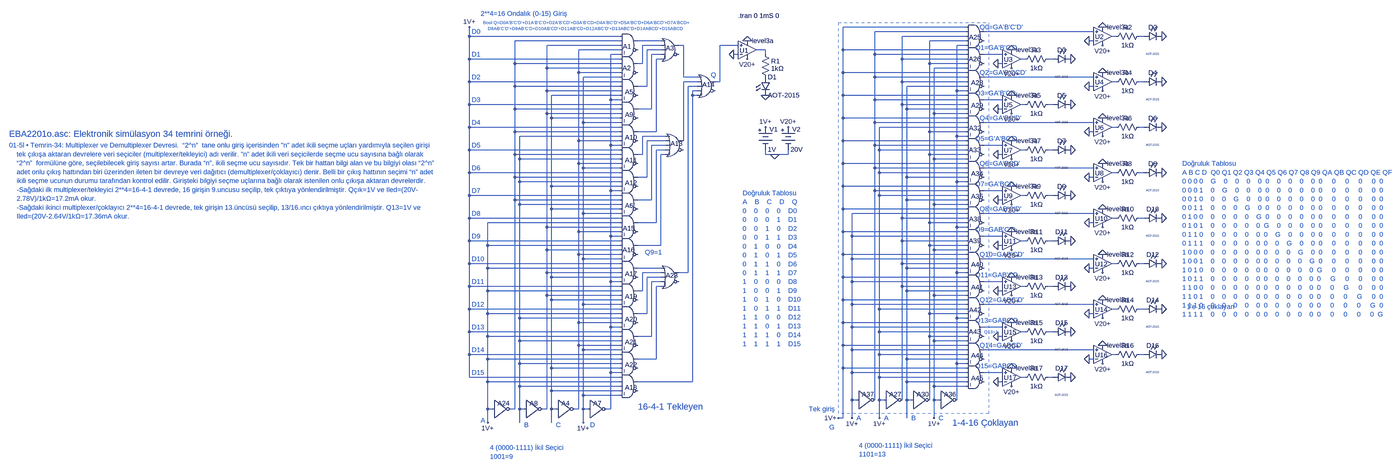
[diagram p0: schematic EBA2201o.asc, whole sheet]
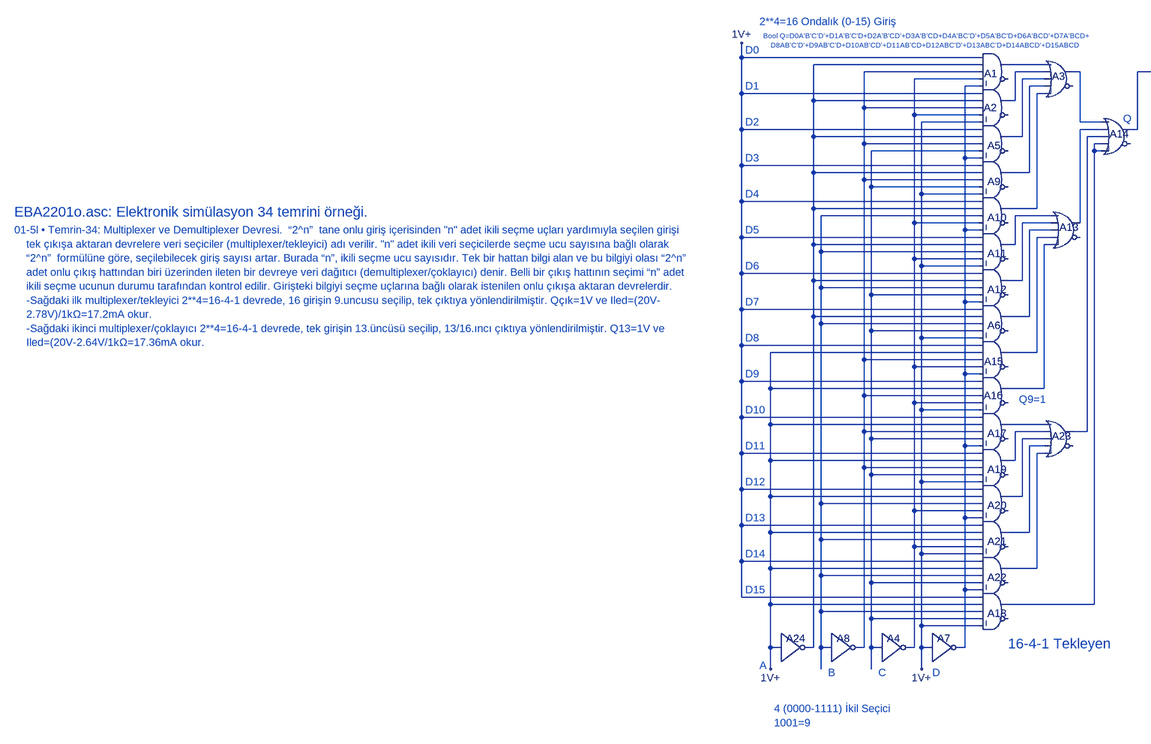
[diagram p1: schematic EBA2201o.asc, part, row 1 of 1, column 1 of 2]
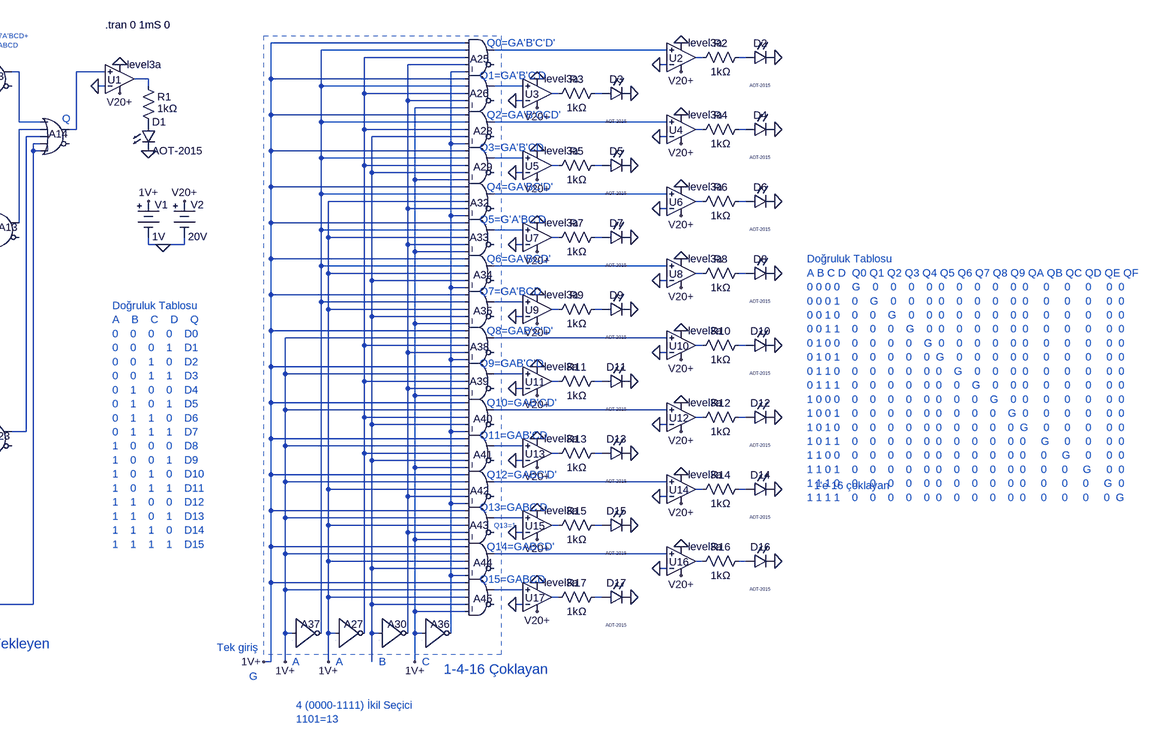
[diagram p2: schematic EBA2201o.asc, part, row 1 of 1, column 2 of 2]
EBA2201o.asc, the LTspice schematic file:
Version 4
SHEET 1 7064 4332
WIRE 4144 -320 3712 -320
WIRE 4144 -304 3824 -304
WIRE 4592 -304 4208 -304
WIRE 2400 -288 2400 -320
WIRE 2928 -288 2400 -288
WIRE 4144 -288 3920 -288
WIRE 4672 -288 4656 -288
WIRE 4768 -288 4752 -288
WIRE 2928 -272 2560 -272
WIRE 3072 -272 2992 -272
WIRE 4144 -272 4016 -272
WIRE 4592 -272 4576 -272
WIRE 2928 -256 2672 -256
WIRE 3072 -256 3008 -256
WIRE 3152 -256 3136 -256
WIRE 3344 -256 3280 -256
WIRE 4144 -256 4112 -256
WIRE 2928 -240 2784 -240
WIRE 3072 -240 3024 -240
WIRE 3440 -240 3408 -240
WIRE 3712 -240 3712 -320
WIRE 4144 -240 3712 -240
WIRE 2928 -224 2896 -224
WIRE 3072 -224 3040 -224
WIRE 3344 -224 3328 -224
WIRE 3440 -224 3440 -240
WIRE 3824 -224 3824 -304
WIRE 4144 -224 3824 -224
WIRE 4272 -224 4208 -224
WIRE 2400 -208 2400 -288
WIRE 2928 -208 2400 -208
WIRE 3072 -208 3056 -208
WIRE 3920 -208 3920 -288
WIRE 4144 -208 3920 -208
WIRE 4352 -208 4336 -208
WIRE 4448 -208 4432 -208
WIRE 2560 -192 2560 -272
WIRE 2928 -192 2560 -192
WIRE 3008 -192 3008 -256
WIRE 3008 -192 2992 -192
WIRE 4016 -192 4016 -272
WIRE 4144 -192 4016 -192
WIRE 4272 -192 4256 -192
WIRE 2672 -176 2672 -256
WIRE 2928 -176 2672 -176
WIRE 4144 -176 4032 -176
WIRE 2784 -160 2784 -240
WIRE 2928 -160 2784 -160
WIRE 3712 -160 3712 -240
WIRE 4144 -160 3712 -160
WIRE 2928 -144 2800 -144
WIRE 3152 -144 3152 -256
WIRE 3200 -144 3152 -144
WIRE 3824 -144 3824 -224
WIRE 4144 -144 3824 -144
WIRE 4592 -144 4208 -144
WIRE 2400 -128 2400 -208
WIRE 2928 -128 2400 -128
WIRE 3200 -128 3152 -128
WIRE 3280 -128 3280 -256
WIRE 3280 -128 3264 -128
WIRE 3920 -128 3920 -208
WIRE 4144 -128 3920 -128
WIRE 4672 -128 4656 -128
WIRE 4768 -128 4752 -128
WIRE 2560 -112 2560 -192
WIRE 2928 -112 2560 -112
WIRE 3024 -112 3024 -240
WIRE 3024 -112 2992 -112
WIRE 3200 -112 3168 -112
WIRE 4144 -112 3936 -112
WIRE 4592 -112 4576 -112
WIRE 2672 -96 2672 -176
WIRE 2928 -96 2672 -96
WIRE 3200 -96 3184 -96
WIRE 4112 -96 4112 -256
WIRE 4144 -96 4112 -96
WIRE 2928 -80 2688 -80
WIRE 3184 -80 3184 -96
WIRE 3200 -80 3184 -80
WIRE 3712 -80 3712 -160
WIRE 4144 -80 3712 -80
WIRE 2896 -64 2896 -224
WIRE 2928 -64 2896 -64
WIRE 3824 -64 3824 -144
WIRE 4144 -64 3824 -64
WIRE 4272 -64 4208 -64
WIRE 2400 -48 2400 -128
WIRE 2928 -48 2400 -48
WIRE 3920 -48 3920 -128
WIRE 4144 -48 3920 -48
WIRE 4352 -48 4336 -48
WIRE 4448 -48 4432 -48
WIRE 2560 -32 2560 -112
WIRE 2928 -32 2560 -32
WIRE 3040 -32 3040 -224
WIRE 3040 -32 2992 -32
WIRE 3936 -32 3936 -112
WIRE 4144 -32 3936 -32
WIRE 4272 -32 4256 -32
WIRE 2672 -16 2672 -96
WIRE 2928 -16 2672 -16
WIRE 4032 -16 4032 -176
WIRE 4144 -16 4032 -16
WIRE 2688 0 2688 -80
WIRE 2928 0 2688 0
WIRE 3712 0 3712 -80
WIRE 4144 0 3712 0
WIRE 2800 16 2800 -144
WIRE 2928 16 2800 16
WIRE 3824 16 3824 -64
WIRE 4144 16 3824 16
WIRE 4592 16 4208 16
WIRE 2400 32 2400 -48
WIRE 2928 32 2400 32
WIRE 4144 32 3840 32
WIRE 4672 32 4656 32
WIRE 4768 32 4752 32
WIRE 2560 48 2560 -32
WIRE 2928 48 2560 48
WIRE 3056 48 3056 -208
WIRE 3056 48 2992 48
WIRE 4016 48 4016 -192
WIRE 4144 48 4016 48
WIRE 4592 48 4576 48
WIRE 2928 64 2576 64
WIRE 3088 64 3008 64
WIRE 4112 64 4112 -96
WIRE 4144 64 4112 64
WIRE 2784 80 2784 -160
WIRE 2928 80 2784 80
WIRE 3088 80 3024 80
WIRE 3152 80 3152 -128
WIRE 3712 80 3712 0
WIRE 4144 80 3712 80
WIRE 2896 96 2896 -64
WIRE 2928 96 2896 96
WIRE 3088 96 3040 96
WIRE 3824 96 3824 16
WIRE 4144 96 3824 96
WIRE 4272 96 4208 96
WIRE 2400 112 2400 32
WIRE 2928 112 2400 112
WIRE 3088 112 3056 112
WIRE 3840 112 3840 32
WIRE 4144 112 3840 112
WIRE 4352 112 4336 112
WIRE 4448 112 4432 112
WIRE 2560 128 2560 48
WIRE 2928 128 2560 128
WIRE 3008 128 3008 64
WIRE 3008 128 2992 128
WIRE 3088 128 3072 128
WIRE 3440 128 3440 112
WIRE 3472 128 3440 128
WIRE 3520 128 3520 112
WIRE 3520 128 3472 128
WIRE 4016 128 4016 48
WIRE 4144 128 4016 128
WIRE 4272 128 4256 128
WIRE 2576 144 2576 64
WIRE 2928 144 2576 144
WIRE 4032 144 4032 -16
WIRE 4144 144 4032 144
WIRE 2784 160 2784 80
WIRE 2928 160 2784 160
WIRE 3712 160 3712 80
WIRE 4144 160 3712 160
WIRE 2800 176 2800 16
WIRE 2928 176 2800 176
WIRE 3824 176 3824 96
WIRE 4144 176 3824 176
WIRE 4592 176 4208 176
WIRE 2400 192 2400 112
WIRE 2928 192 2400 192
WIRE 3840 192 3840 112
WIRE 4144 192 3840 192
WIRE 4672 192 4656 192
WIRE 4768 192 4752 192
WIRE 2560 208 2560 128
WIRE 2928 208 2560 208
WIRE 3024 208 3024 80
WIRE 3024 208 2992 208
WIRE 3936 208 3936 -32
WIRE 4144 208 3936 208
WIRE 4592 208 4576 208
WIRE 2576 224 2576 144
WIRE 2928 224 2576 224
WIRE 4112 224 4112 64
WIRE 4144 224 4112 224
WIRE 2688 240 2688 0
WIRE 2928 240 2688 240
WIRE 3712 240 3712 160
WIRE 4144 240 3712 240
WIRE 2896 256 2896 96
WIRE 2928 256 2896 256
WIRE 3824 256 3824 176
WIRE 4144 256 3824 256
WIRE 4272 256 4208 256
WIRE 2400 272 2400 192
WIRE 2928 272 2400 272
WIRE 3840 272 3840 192
WIRE 4144 272 3840 272
WIRE 4352 272 4336 272
WIRE 4448 272 4432 272
WIRE 2560 288 2560 208
WIRE 2928 288 2560 288
WIRE 3040 288 3040 96
WIRE 3040 288 2992 288
WIRE 3936 288 3936 208
WIRE 4144 288 3936 288
WIRE 4272 288 4256 288
WIRE 2576 304 2576 224
WIRE 2928 304 2576 304
WIRE 4032 304 4032 144
WIRE 4144 304 4032 304
WIRE 2688 320 2688 240
WIRE 2928 320 2688 320
WIRE 3712 320 3712 240
WIRE 4144 320 3712 320
WIRE 2800 336 2800 176
WIRE 2928 336 2800 336
WIRE 4144 336 3744 336
WIRE 4592 336 4208 336
WIRE 2400 352 2400 272
WIRE 2928 352 2400 352
WIRE 3920 352 3920 -48
WIRE 4144 352 3920 352
WIRE 4672 352 4656 352
WIRE 4768 352 4752 352
WIRE 2928 368 2464 368
WIRE 3056 368 3056 112
WIRE 3056 368 2992 368
WIRE 4016 368 4016 128
WIRE 4144 368 4016 368
WIRE 4592 368 4576 368
WIRE 2672 384 2672 -16
WIRE 2928 384 2672 384
WIRE 4112 384 4112 224
WIRE 4144 384 4112 384
WIRE 2784 400 2784 160
WIRE 2928 400 2784 400
WIRE 3712 400 3712 320
WIRE 4144 400 3712 400
WIRE 2896 416 2896 256
WIRE 2928 416 2896 416
WIRE 3744 416 3744 336
WIRE 4144 416 3744 416
WIRE 4272 416 4208 416
WIRE 2400 432 2400 352
WIRE 2928 432 2400 432
WIRE 3920 432 3920 352
WIRE 4144 432 3920 432
WIRE 4352 432 4336 432
WIRE 4448 432 4432 432
WIRE 2464 448 2464 368
WIRE 2928 448 2464 448
WIRE 3072 448 3072 128
WIRE 3072 448 2992 448
WIRE 4016 448 4016 368
WIRE 4144 448 4016 448
WIRE 4272 448 4256 448
WIRE 2672 464 2672 384
WIRE 2928 464 2672 464
WIRE 4032 464 4032 304
WIRE 4144 464 4032 464
WIRE 2784 480 2784 400
WIRE 2928 480 2784 480
WIRE 3712 480 3712 400
WIRE 4144 480 3712 480
WIRE 2800 496 2800 336
WIRE 2928 496 2800 496
WIRE 3744 496 3744 416
WIRE 4144 496 3744 496
WIRE 4592 496 4208 496
WIRE 2400 512 2400 432
WIRE 2928 512 2400 512
WIRE 3920 512 3920 432
WIRE 4144 512 3920 512
WIRE 4672 512 4656 512
WIRE 4768 512 4752 512
WIRE 2464 528 2464 448
WIRE 2928 528 2464 528
WIRE 3072 528 2992 528
WIRE 3936 528 3936 288
WIRE 4144 528 3936 528
WIRE 4592 528 4576 528
WIRE 2672 544 2672 464
WIRE 2928 544 2672 544
WIRE 3072 544 3008 544
WIRE 3168 544 3168 -112
WIRE 3168 544 3136 544
WIRE 4112 544 4112 384
WIRE 4144 544 4112 544
WIRE 2688 560 2688 320
WIRE 2928 560 2688 560
WIRE 3072 560 3024 560
WIRE 3712 560 3712 480
WIRE 4144 560 3712 560
WIRE 2896 576 2896 416
WIRE 2928 576 2896 576
WIRE 3072 576 3040 576
WIRE 3744 576 3744 496
WIRE 4144 576 3744 576
WIRE 4272 576 4208 576
WIRE 2400 592 2400 512
WIRE 2928 592 2400 592
WIRE 3072 592 3056 592
WIRE 3920 592 3920 512
WIRE 4144 592 3920 592
WIRE 4352 592 4336 592
WIRE 4448 592 4432 592
WIRE 2464 608 2464 528
WIRE 2928 608 2464 608
WIRE 3008 608 3008 544
WIRE 3008 608 2992 608
WIRE 3936 608 3936 528
WIRE 4144 608 3936 608
WIRE 4272 608 4256 608
WIRE 2672 624 2672 544
WIRE 2928 624 2672 624
WIRE 4032 624 4032 464
WIRE 4144 624 4032 624
WIRE 2688 640 2688 560
WIRE 2928 640 2688 640
WIRE 3712 640 3712 560
WIRE 4144 640 3712 640
WIRE 2800 656 2800 496
WIRE 2928 656 2800 656
WIRE 3744 656 3744 576
WIRE 4144 656 3744 656
WIRE 4592 656 4208 656
WIRE 2400 672 2400 592
WIRE 2928 672 2400 672
WIRE 3840 672 3840 272
WIRE 4144 672 3840 672
WIRE 4672 672 4656 672
WIRE 4768 672 4752 672
WIRE 2464 688 2464 608
WIRE 2928 688 2464 688
WIRE 3024 688 3024 560
WIRE 3024 688 2992 688
WIRE 4016 688 4016 448
WIRE 4144 688 4016 688
WIRE 4592 688 4576 688
WIRE 2576 704 2576 304
WIRE 2928 704 2576 704
WIRE 4112 704 4112 544
WIRE 4144 704 4112 704
WIRE 2784 720 2784 480
WIRE 2928 720 2784 720
WIRE 3712 720 3712 640
WIRE 4144 720 3712 720
WIRE 2896 736 2896 576
WIRE 2928 736 2896 736
WIRE 3744 736 3744 656
WIRE 4144 736 3744 736
WIRE 4272 736 4208 736
WIRE 2400 752 2400 672
WIRE 2928 752 2400 752
WIRE 3840 752 3840 672
WIRE 4144 752 3840 752
WIRE 4352 752 4336 752
WIRE 4448 752 4432 752
WIRE 2464 768 2464 688
WIRE 2928 768 2464 768
WIRE 3040 768 3040 576
WIRE 3040 768 2992 768
WIRE 4016 768 4016 688
WIRE 4144 768 4016 768
WIRE 4272 768 4256 768
WIRE 2576 784 2576 704
WIRE 2928 784 2576 784
WIRE 4032 784 4032 624
WIRE 4144 784 4032 784
WIRE 2784 800 2784 720
WIRE 2928 800 2784 800
WIRE 3712 800 3712 720
WIRE 4144 800 3712 800
WIRE 2800 816 2800 656
WIRE 2928 816 2800 816
WIRE 3744 816 3744 736
WIRE 4144 816 3744 816
WIRE 4592 816 4208 816
WIRE 2400 832 2400 752
WIRE 2928 832 2400 832
WIRE 3840 832 3840 752
WIRE 4144 832 3840 832
WIRE 4672 832 4656 832
WIRE 4768 832 4752 832
WIRE 2464 848 2464 768
WIRE 2928 848 2464 848
WIRE 3056 848 3056 592
WIRE 3056 848 2992 848
WIRE 3936 848 3936 608
WIRE 4144 848 3936 848
WIRE 4592 848 4576 848
WIRE 2576 864 2576 784
WIRE 2928 864 2576 864
WIRE 4112 864 4112 704
WIRE 4144 864 4112 864
WIRE 2688 880 2688 640
WIRE 2928 880 2688 880
WIRE 3712 880 3712 800
WIRE 4144 880 3712 880
WIRE 2896 896 2896 736
WIRE 2928 896 2896 896
WIRE 3744 896 3744 816
WIRE 4144 896 3744 896
WIRE 4272 896 4208 896
WIRE 2400 912 2400 832
WIRE 2928 912 2400 912
WIRE 3840 912 3840 832
WIRE 4144 912 3840 912
WIRE 4352 912 4336 912
WIRE 4448 912 4432 912
WIRE 2464 928 2464 848
WIRE 2928 928 2464 928
WIRE 3184 928 3184 -80
WIRE 3184 928 2992 928
WIRE 3936 928 3936 848
WIRE 4144 928 3936 928
WIRE 4272 928 4256 928
WIRE 2576 944 2576 864
WIRE 2928 944 2576 944
WIRE 4032 944 4032 784
WIRE 4144 944 4032 944
WIRE 2688 960 2688 880
WIRE 2928 960 2688 960
WIRE 2800 976 2800 816
WIRE 2928 976 2800 976
WIRE 3744 992 3744 896
WIRE 3760 992 3744 992
WIRE 3824 992 3824 256
WIRE 3840 992 3840 912
WIRE 3856 992 3840 992
WIRE 3920 992 3920 592
WIRE 3936 992 3936 928
WIRE 3952 992 3936 992
WIRE 4016 992 4016 768
WIRE 4032 992 4032 944
WIRE 4048 992 4032 992
WIRE 4112 992 4112 864
WIRE 2464 1024 2464 928
WIRE 2480 1024 2464 1024
WIRE 2560 1024 2560 288
WIRE 2560 1024 2544 1024
WIRE 2576 1024 2576 944
WIRE 2592 1024 2576 1024
WIRE 2672 1024 2672 624
WIRE 2672 1024 2656 1024
WIRE 2688 1024 2688 960
WIRE 2704 1024 2688 1024
WIRE 2784 1024 2784 800
WIRE 2784 1024 2768 1024
WIRE 2800 1024 2800 976
WIRE 2816 1024 2800 1024
WIRE 2896 1024 2896 896
WIRE 2896 1024 2880 1024
WIRE 3712 1056 3712 880
WIRE 3712 1056 3696 1056
WIRE 3744 1056 3744 992
WIRE 3840 1056 3840 992
WIRE 3936 1056 3936 992
WIRE 4032 1056 4032 992
WIRE 2464 1072 2464 1024
WIRE 2576 1072 2576 1024
WIRE 2688 1072 2688 1024
WIRE 2800 1072 2800 1024
FLAG 3440 32 1V+
FLAG 3472 128 0
FLAG 3376 -272 0
FLAG 3376 -208 V20+
FLAG 3328 -224 0
FLAG 3440 -80 0
FLAG 4624 -320 0
FLAG 4624 -256 V20+
FLAG 4576 -272 0
FLAG 4832 -288 0
FLAG 4304 -240 0
FLAG 4304 -176 V20+
FLAG 4256 -192 0
FLAG 4512 -208 0
FLAG 4624 -160 0
FLAG 4624 -96 V20+
FLAG 4576 -112 0
FLAG 4832 -128 0
FLAG 4304 -80 0
FLAG 4304 -16 V20+
FLAG 4256 -32 0
FLAG 4512 -48 0
FLAG 4624 0 0
FLAG 4624 64 V20+
FLAG 4576 48 0
FLAG 4832 32 0
FLAG 4304 80 0
FLAG 4304 144 V20+
FLAG 4256 128 0
FLAG 4512 112 0
FLAG 4624 160 0
FLAG 4624 224 V20+
FLAG 4576 208 0
FLAG 4832 192 0
FLAG 4304 240 0
FLAG 4304 304 V20+
FLAG 4256 288 0
FLAG 4512 272 0
FLAG 4624 320 0
FLAG 4624 384 V20+
FLAG 4576 368 0
FLAG 4832 352 0
FLAG 4304 400 0
FLAG 4304 464 V20+
FLAG 4256 448 0
FLAG 4512 432 0
FLAG 4624 480 0
FLAG 4624 544 V20+
FLAG 4576 528 0
FLAG 4832 512 0
FLAG 4304 560 0
FLAG 4304 624 V20+
FLAG 4256 608 0
FLAG 4512 592 0
FLAG 4624 640 0
FLAG 4624 704 V20+
FLAG 4576 688 0
FLAG 4832 672 0
FLAG 4304 720 0
FLAG 4304 784 V20+
FLAG 4256 768 0
FLAG 4512 752 0
FLAG 4624 800 0
FLAG 4624 864 V20+
FLAG 4576 848 0
FLAG 4832 832 0
FLAG 4304 880 0
FLAG 4304 944 V20+
FLAG 4256 928 0
FLAG 4512 912 0
FLAG 2400 -320 1V+
FLAG 3744 1056 1V+
FLAG 2464 1072 1V+
FLAG 2800 1072 1V+
FLAG 3696 1056 1V+
FLAG 3840 1056 1V+
FLAG 3520 32 V20+
FLAG 4032 1056 1V+
SYMBOL Misc\\battery 3440 16 R0
WINDOW 3 8 95 Left 2
WINDOW 0 14 24 Left 2
SYMATTR Value 1V
SYMATTR InstName V1
SYMBOL Digital\\and 2960 -320 R0
WINDOW 0 -21 68 Left 2
SYMATTR InstName A1
SYMBOL Digital\\and 2960 -240 R0
WINDOW 0 -22 64 Left 2
SYMATTR InstName A2
SYMBOL Digital\\or 3104 -304 R0
WINDOW 0 -14 58 Left 2
SYMATTR InstName A3
SYMBOL Digital\\inv 2704 960 R0
WINDOW 0 19 44 Left 2
SYMATTR InstName A4
SYMBOL Digital\\and 2960 -160 R0
WINDOW 0 -14 68 Left 2
SYMATTR InstName A5
SYMBOL Digital\\and 2960 240 R0
WINDOW 0 -14 68 Left 2
SYMATTR InstName A6
SYMBOL Digital\\inv 2816 960 R0
WINDOW 0 19 44 Left 2
SYMATTR InstName A7
SYMBOL OpAmps\\UniversalOpAmp3 3376 -240 M180
WINDOW 0 -27 -2 Left 2
SYMATTR InstName U1
SYMBOL res 3424 -240 R0
WINDOW 3 36 66 Left 2
SYMATTR Value 1kΩ
SYMATTR InstName R1
SYMBOL LED 3424 -144 R0
SYMATTR InstName D1
SYMATTR Value AOT-2015
SYMATTR Description Diode
SYMATTR Type diode
SYMBOL Digital\\inv 2592 960 R0
WINDOW 0 19 44 Left 2
SYMATTR InstName A8
SYMBOL Digital\\and 2960 -80 R0
WINDOW 0 -14 68 Left 2
SYMATTR InstName A9
SYMBOL Digital\\and 2960 0 R0
WINDOW 0 -14 68 Left 2
SYMATTR InstName A10
SYMBOL Digital\\and 2960 80 R0
WINDOW 0 -14 68 Left 2
SYMATTR InstName A11
SYMBOL Digital\\and 2960 160 R0
WINDOW 0 -14 68 Left 2
SYMATTR InstName A12
SYMBOL Digital\\or 3120 32 R0
WINDOW 0 -14 58 Left 2
SYMATTR InstName A13
SYMBOL Digital\\or 3232 -176 R0
WINDOW 0 -14 58 Left 2
SYMATTR InstName A14
SYMBOL Digital\\and 2960 320 R0
WINDOW 0 -21 68 Left 2
SYMATTR InstName A15
SYMBOL Digital\\and 2960 400 R0
WINDOW 0 -22 64 Left 2
SYMATTR InstName A16
SYMBOL Digital\\and 2960 480 R0
WINDOW 0 -14 68 Left 2
SYMATTR InstName A17
SYMBOL Digital\\and 2960 880 R0
WINDOW 0 -14 68 Left 2
SYMATTR InstName A18
SYMBOL Digital\\and 2960 560 R0
WINDOW 0 -14 68 Left 2
SYMATTR InstName A19
SYMBOL Digital\\and 2960 640 R0
WINDOW 0 -14 68 Left 2
SYMATTR InstName A20
SYMBOL Digital\\and 2960 720 R0
WINDOW 0 -14 68 Left 2
SYMATTR InstName A21
SYMBOL Digital\\and 2960 800 R0
WINDOW 0 -14 68 Left 2
SYMATTR InstName A22
SYMBOL Digital\\or 3104 496 R0
WINDOW 0 -14 58 Left 2
SYMATTR InstName A23
SYMBOL Digital\\inv 2480 960 R0
WINDOW 0 19 44 Left 2
SYMATTR InstName A24
SYMBOL Digital\\and 4176 -352 R0
WINDOW 0 -21 68 Left 2
SYMATTR InstName A25
SYMBOL Digital\\and 4176 -272 R0
WINDOW 0 -22 64 Left 2
SYMATTR InstName A26
SYMBOL Digital\\inv 3856 928 R0
WINDOW 0 19 44 Left 2
SYMATTR InstName A27
SYMBOL Digital\\and 4176 -192 R0
WINDOW 0 -14 68 Left 2
SYMATTR InstName A28
SYMBOL Digital\\and 4176 -112 R0
WINDOW 0 -14 68 Left 2
SYMATTR InstName A29
SYMBOL Digital\\inv 3952 928 R0
WINDOW 0 19 44 Left 2
SYMATTR InstName A30
SYMBOL OpAmps\\UniversalOpAmp3 4624 -288 M180
WINDOW 0 -27 -2 Left 2
SYMATTR InstName U2
SYMBOL res 4768 -304 R90
WINDOW 0 0 56 VBottom 2
WINDOW 3 32 56 VTop 2
SYMATTR InstName R2
SYMATTR Value 1kΩ
SYMBOL LED 4768 -304 M90
WINDOW 0 0 32 VBottom 2
WINDOW 3 72 32 VTop 0
SYMATTR InstName D2
SYMATTR Value AOT-2015
SYMATTR Description Diode
SYMATTR Type diode
SYMBOL OpAmps\\UniversalOpAmp3 4304 -208 M180
WINDOW 0 -27 -2 Left 2
SYMATTR InstName U3
SYMBOL res 4448 -224 R90
WINDOW 0 0 56 VBottom 2
WINDOW 3 32 56 VTop 2
SYMATTR InstName R3
SYMATTR Value 1kΩ
SYMBOL LED 4448 -224 M90
WINDOW 0 0 32 VBottom 2
WINDOW 3 72 32 VTop 0
SYMATTR InstName D3
SYMATTR Value AOT-2015
SYMATTR Description Diode
SYMATTR Type diode
SYMBOL OpAmps\\UniversalOpAmp3 4624 -128 M180
WINDOW 0 -27 -2 Left 2
SYMATTR InstName U4
SYMBOL res 4768 -144 R90
WINDOW 0 0 56 VBottom 2
WINDOW 3 32 56 VTop 2
SYMATTR InstName R4
SYMATTR Value 1kΩ
SYMBOL LED 4768 -144 M90
WINDOW 0 0 32 VBottom 2
WINDOW 3 72 32 VTop 0
SYMATTR InstName D4
SYMATTR Value AOT-2015
SYMATTR Description Diode
SYMATTR Type diode
SYMBOL OpAmps\\UniversalOpAmp3 4304 -48 M180
WINDOW 0 -27 -2 Left 2
SYMATTR InstName U5
SYMBOL res 4448 -64 R90
WINDOW 0 0 56 VBottom 2
WINDOW 3 32 56 VTop 2
SYMATTR InstName R5
SYMATTR Value 1kΩ
SYMBOL LED 4448 -64 M90
WINDOW 0 0 32 VBottom 2
WINDOW 3 72 32 VTop 0
SYMATTR InstName D5
SYMATTR Value AOT-2015
SYMATTR Description Diode
SYMATTR Type diode
SYMBOL Digital\\and 4176 -32 R0
WINDOW 0 -21 68 Left 2
SYMATTR InstName A32
SYMBOL Digital\\and 4176 48 R0
WINDOW 0 -22 64 Left 2
SYMATTR InstName A33
SYMBOL Digital\\and 4176 128 R0
WINDOW 0 -14 68 Left 2
SYMATTR InstName A34
SYMBOL Digital\\and 4176 208 R0
WINDOW 0 -14 68 Left 2
SYMATTR InstName A35
SYMBOL OpAmps\\UniversalOpAmp3 4624 32 M180
WINDOW 0 -27 -2 Left 2
SYMATTR InstName U6
SYMBOL res 4768 16 R90
WINDOW 0 0 56 VBottom 2
WINDOW 3 32 56 VTop 2
SYMATTR InstName R6
SYMATTR Value 1kΩ
SYMBOL LED 4768 16 M90
WINDOW 0 0 32 VBottom 2
WINDOW 3 72 32 VTop 0
SYMATTR InstName D6
SYMATTR Value AOT-2015
SYMATTR Description Diode
SYMATTR Type diode
SYMBOL OpAmps\\UniversalOpAmp3 4304 112 M180
WINDOW 0 -27 -2 Left 2
SYMATTR InstName U7
SYMBOL res 4448 96 R90
WINDOW 0 0 56 VBottom 2
WINDOW 3 32 56 VTop 2
SYMATTR InstName R7
SYMATTR Value 1kΩ
SYMBOL LED 4448 96 M90
WINDOW 0 0 32 VBottom 2
WINDOW 3 72 32 VTop 0
SYMATTR InstName D7
SYMATTR Value AOT-2015
SYMATTR Description Diode
SYMATTR Type diode
SYMBOL OpAmps\\UniversalOpAmp3 4624 192 M180
WINDOW 0 -27 -2 Left 2
SYMATTR InstName U8
SYMBOL res 4768 176 R90
WINDOW 0 0 56 VBottom 2
WINDOW 3 32 56 VTop 2
SYMATTR InstName R8
SYMATTR Value 1kΩ
SYMBOL LED 4768 176 M90
WINDOW 0 0 32 VBottom 2
WINDOW 3 72 32 VTop 0
SYMATTR InstName D8
SYMATTR Value AOT-2015
SYMATTR Description Diode
SYMATTR Type diode
SYMBOL OpAmps\\UniversalOpAmp3 4304 272 M180
WINDOW 0 -27 -2 Left 2
SYMATTR InstName U9
SYMBOL res 4448 256 R90
WINDOW 0 0 56 VBottom 2
WINDOW 3 32 56 VTop 2
SYMATTR InstName R9
SYMATTR Value 1kΩ
SYMBOL LED 4448 256 M90
WINDOW 0 0 32 VBottom 2
WINDOW 3 72 32 VTop 0
SYMATTR InstName D9
SYMATTR Value AOT-2015
SYMATTR Description Diode
SYMATTR Type diode
SYMBOL Digital\\inv 4048 928 R0
WINDOW 0 19 44 Left 2
SYMATTR InstName A36
SYMBOL Digital\\inv 3760 928 R0
WINDOW 0 19 44 Left 2
SYMATTR InstName A37
SYMBOL Digital\\and 4176 288 R0
WINDOW 0 -21 68 Left 2
SYMATTR InstName A38
SYMBOL Digital\\and 4176 368 R0
WINDOW 0 -22 64 Left 2
SYMATTR InstName A39
SYMBOL Digital\\and 4176 448 R0
WINDOW 0 -14 68 Left 2
SYMATTR InstName A40
SYMBOL Digital\\and 4176 528 R0
WINDOW 0 -14 68 Left 2
SYMATTR InstName A41
SYMBOL OpAmps\\UniversalOpAmp3 4624 352 M180
WINDOW 0 -27 -2 Left 2
SYMATTR InstName U10
SYMBOL res 4768 336 R90
WINDOW 0 0 56 VBottom 2
WINDOW 3 32 56 VTop 2
SYMATTR InstName R10
SYMATTR Value 1kΩ
SYMBOL LED 4768 336 M90
WINDOW 0 0 32 VBottom 2
WINDOW 3 72 32 VTop 0
SYMATTR InstName D10
SYMATTR Value AOT-2015
SYMATTR Description Diode
SYMATTR Type diode
SYMBOL OpAmps\\UniversalOpAmp3 4304 432 M180
WINDOW 0 -27 -2 Left 2
SYMATTR InstName U11
SYMBOL res 4448 416 R90
WINDOW 0 0 56 VBottom 2
WINDOW 3 32 56 VTop 2
SYMATTR InstName R11
SYMATTR Value 1kΩ
SYMBOL LED 4448 416 M90
WINDOW 0 0 32 VBottom 2
WINDOW 3 72 32 VTop 0
SYMATTR InstName D11
SYMATTR Value AOT-2015
SYMATTR Description Diode
SYMATTR Type diode
SYMBOL OpAmps\\UniversalOpAmp3 4624 512 M180
WINDOW 0 -27 -2 Left 2
SYMATTR InstName U12
SYMBOL res 4768 496 R90
WINDOW 0 0 56 VBottom 2
WINDOW 3 32 56 VTop 2
SYMATTR InstName R12
SYMATTR Value 1kΩ
SYMBOL LED 4768 496 M90
WINDOW 0 0 32 VBottom 2
WINDOW 3 72 32 VTop 0
SYMATTR InstName D12
SYMATTR Value AOT-2015
SYMATTR Description Diode
SYMATTR Type diode
SYMBOL OpAmps\\UniversalOpAmp3 4304 592 M180
WINDOW 0 -27 -2 Left 2
SYMATTR InstName U13
SYMBOL res 4448 576 R90
WINDOW 0 0 56 VBottom 2
WINDOW 3 32 56 VTop 2
SYMATTR InstName R13
SYMATTR Value 1kΩ
SYMBOL LED 4448 576 M90
WINDOW 0 0 32 VBottom 2
WINDOW 3 72 32 VTop 0
SYMATTR InstName D13
SYMATTR Value AOT-2015
SYMATTR Description Diode
SYMATTR Type diode
SYMBOL Digital\\and 4176 608 R0
WINDOW 0 -21 68 Left 2
SYMATTR InstName A42
SYMBOL Digital\\and 4176 688 R0
WINDOW 0 -22 64 Left 2
SYMATTR InstName A43
SYMBOL Digital\\and 4176 768 R0
WINDOW 0 -14 68 Left 2
SYMATTR InstName A44
SYMBOL Digital\\and 4176 848 R0
WINDOW 0 -14 68 Left 2
SYMATTR InstName A45
SYMBOL OpAmps\\UniversalOpAmp3 4624 672 M180
WINDOW 0 -27 -2 Left 2
SYMATTR InstName U14
SYMBOL res 4768 656 R90
WINDOW 0 0 56 VBottom 2
WINDOW 3 32 56 VTop 2
SYMATTR InstName R14
SYMATTR Value 1kΩ
SYMBOL LED 4768 656 M90
WINDOW 0 0 32 VBottom 2
WINDOW 3 72 32 VTop 0
SYMATTR InstName D14
SYMATTR Value AOT-2015
SYMATTR Description Diode
SYMATTR Type diode
SYMBOL OpAmps\\UniversalOpAmp3 4304 752 M180
WINDOW 0 -27 -2 Left 2
SYMATTR InstName U15
SYMBOL res 4448 736 R90
WINDOW 0 0 56 VBottom 2
WINDOW 3 32 56 VTop 2
SYMATTR InstName R15
SYMATTR Value 1kΩ
SYMBOL LED 4448 736 M90
WINDOW 0 0 32 VBottom 2
WINDOW 3 72 32 VTop 0
SYMATTR InstName D15
SYMATTR Value AOT-2015
SYMATTR Description Diode
SYMATTR Type diode
SYMBOL OpAmps\\UniversalOpAmp3 4624 832 M180
WINDOW 0 -27 -2 Left 2
SYMATTR InstName U16
SYMBOL res 4768 816 R90
WINDOW 0 0 56 VBottom 2
WINDOW 3 32 56 VTop 2
SYMATTR InstName R16
SYMATTR Value 1kΩ
SYMBOL LED 4768 816 M90
WINDOW 0 0 32 VBottom 2
WINDOW 3 72 32 VTop 0
SYMATTR InstName D16
SYMATTR Value AOT-2015
SYMATTR Description Diode
SYMATTR Type diode
SYMBOL OpAmps\\UniversalOpAmp3 4304 912 M180
WINDOW 0 -27 -2 Left 2
SYMATTR InstName U17
SYMBOL res 4448 896 R90
WINDOW 0 0 56 VBottom 2
WINDOW 3 32 56 VTop 2
SYMATTR InstName R17
SYMATTR Value 1kΩ
SYMBOL LED 4448 896 M90
WINDOW 0 0 32 VBottom 2
WINDOW 3 72 32 VTop 0
SYMATTR InstName D17
SYMATTR Value AOT-2015
SYMATTR Description Diode
SYMATTR Type diode
SYMBOL Misc\\battery 3520 16 R0
WINDOW 3 8 95 Left 2
WINDOW 0 14 24 Left 2
SYMATTR Value 20V
SYMATTR InstName V2
TEXT -232 56 Left 3 ;EBA2201o.asc: Elektronik simülasyon 34 temrini örneği.
TEXT -232 96 Left 2 ;01-5l • Temrin-34: Multiplexer ve Demultiplexer Devresi.  “2^n”  tane onlu giriş içerisinden "n" adet ikili seçme uçları yardımıyla seçilen girişi \n    tek çıkışa aktaran devrelere veri seçiciler (multiplexer/tekleyici) adı verilir. "n" adet ikili veri seçicilerde seçme ucu sayısına bağlı olarak \n    “2^n”  formülüne göre, seçilebilecek giriş sayısı artar. Burada “n”, ikili seçme ucu sayısıdır. Tek bir hattan bilgi alan ve bu bilgiyi olası “2^n”\n    adet onlu çıkış hattından biri üzerinden ileten bir devreye veri dağıtıcı (demultiplexer/çoklayıcı) denir. Belli bir çıkış hattının seçimi “n” adet \n    ikili seçme ucunun durumu tarafından kontrol edilir. Girişteki bilgiyi seçme uçlarına bağlı olarak istenilen onlu çıkışa aktaran devrelerdir.\n    -Sağdaki ilk multiplexer/tekleyici 2**4=16-4-1 devrede, 16 girişin 9.uncusu seçilip, tek çıktıya yönlendirilmiştir. Qçık=1V ve Iled=(20V-\n    2.78V)/1kΩ=17.2mA okur.\n    -Sağdaki ikinci multiplexer/çoklayıcı 2**4=16-4-1 devrede, tek girişin 13.üncüsü seçilip, 13/16.ıncı çıktıya yönlendirilmiştir. Q13=1V ve \n    Iled=(20V-2.64V/1kΩ=17.36mA okur.
TEXT 2408 -304 Left 2 ;D0
TEXT 2408 -224 Left 2 ;D1
TEXT 2448 -336 Left 1 ;Bool Q=D0A'B'C'D'+D1A'B'C'D+D2A'B'CD'+D3A'B'CD+D4A'BC'D'+D5A'BC'D+D6A'BCD'+D7A'BCD+\n    D8AB'C'D'+D9AB'C'D+D10AB'CD'+D11AB'CD+D12ABC'D'+D13ABC'D+D14ABCD'+D15ABCD
TEXT 2704 1080 Left 2 ;C
TEXT 2992 1016 Left 3 ;16-4-1 Tekleyen
TEXT 2408 -144 Left 2 ;D2
TEXT 2408 -64 Left 2 ;D3
TEXT 2824 1080 Left 2 ;D
TEXT 2592 1080 Left 2 ;B
TEXT 2408 16 Left 2 ;D4
TEXT 2408 96 Left 2 ;D5
TEXT 2408 176 Left 2 ;D6
TEXT 2408 256 Left 2 ;D7
TEXT 2440 -368 Left 2 ;2**4=16 Ondalık (0-15) Giriş
TEXT 2472 1160 Left 2 ;4 (0000-1111) İkil Seçici\n1001=9
TEXT 3248 -152 Left 2 ;Q
TEXT 2408 336 Left 2 ;D8
TEXT 2408 416 Left 2 ;D9
TEXT 2408 496 Left 2 ;D10
TEXT 2408 576 Left 2 ;D11
TEXT 2408 656 Left 2 ;D12
TEXT 2408 736 Left 2 ;D13
TEXT 2408 816 Left 2 ;D14
TEXT 2408 896 Left 2 ;D15
TEXT 2440 1064 Left 2 ;A
TEXT 3360 264 Left 2 ;Doğruluk Tablosu\nA    B    C    D    Q\n0    0    0    0    D0\n0    0    0    1    D1\n0    0    1    0    D2\n0    0    1    1    D3\n0    1    0    0    D4\n0    1    0    1    D5\n0    1    1    0    D6\n0    1    1    1    D7\n1    0    0    0    D8\n1    0    0    1    D9\n1    0    1    0    D10\n1    0    1    1    D11\n1    1    0    0    D12\n1    1    0    1    D13\n1    1    1    0    D14\n1    1    1    1    D15
TEXT 3856 1056 Left 2 ;A
TEXT 4096 1072 Left 3 ;1-4-16 Çoklayan
TEXT 3952 1056 Left 2 ;B
TEXT 3664 1088 Left 2 ;G
TEXT 4176 -88 Left 2 ;Q3=GA'B'CD
TEXT 4192 -160 Left 2 ;Q2=GA'B'CCD'
TEXT 4176 -248 Left 2 ;Q1=GA'B'C'D
TEXT 4192 -320 Left 2 ;Q0=GA'B'C'D'
TEXT 3592 1024 Left 2 ;Tek giriş
TEXT 4176 232 Left 2 ;Q7=GA'BCD
TEXT 4192 160 Left 2 ;Q6=GA'BCD'
TEXT 4176 72 Left 2 ;Q5=G'A'BC'D
TEXT 4192 0 Left 2 ;Q4=GA'BC'D'
TEXT 4048 1056 Left 2 ;C
TEXT 3760 1056 Left 2 ;A
TEXT 4176 552 Left 2 ;Q11=GAB'CD
TEXT 4192 480 Left 2 ;Q10=GAB'CD'
TEXT 4176 392 Left 2 ;Q9=GAB'C'D
TEXT 4192 320 Left 2 ;Q8=GAB'C'D'
TEXT 4176 872 Left 2 ;Q15=GABCD
TEXT 4192 800 Left 2 ;Q14=GABCD'
TEXT 4176 712 Left 2 ;Q13=GABC'D
TEXT 4192 640 Left 2 ;Q12=GABC'D'
TEXT 4920 664 Left 2 ;1'e 16 çoklayan
TEXT 4904 160 Left 2 ;Doğruluk Tablosu\nA B C D  Q0 Q1 Q2 Q3 Q4 Q5 Q6 Q7 Q8 Q9 QA QB QC QD QE QF\n0 0 0 0    G    0    0    0    0  0    0    0    0    0  0     0     0     0     0  0\n0 0 0 1    0    G    0    0    0  0    0    0    0    0  0     0     0     0     0  0\n0 0 1 0    0    0    G    0    0  0    0    0    0    0  0     0     0     0     0  0\n0 0 1 1    0    0    0    G    0  0    0    0    0    0  0     0     0     0     0  0\n0 1 0 0    0    0    0    0    G  0    0    0    0    0  0     0     0     0     0  0\n0 1 0 1    0    0    0    0    0  G    0    0    0    0  0     0     0     0     0  0\n0 1 1 0    0    0    0    0    0  0    G    0    0    0  0     0     0     0     0  0\n0 1 1 1    0    0    0    0    0  0    0    G    0    0  0     0     0     0     0  0\n1 0 0 0    0    0    0    0    0  0    0    0    G    0  0     0     0     0     0  0\n1 0 0 1    0    0    0    0    0  0    0    0    0    G  0     0     0     0     0  0\n1 0 1 0    0    0    0    0    0  0    0    0    0    0  G     0     0     0     0  0\n1 0 1 1    0    0    0    0    0  0    0    0    0    0  0     G     0     0     0  0\n1 1 0 0    0    0    0    0    0  0    0    0    0    0  0     0     G     0     0  0\n1 1 0 1    0    0    0    0    0  0    0    0    0    0  0     0     0     G     0  0\n1 1 1 0    0    0    0    0    0  0    0    0    0    0  0     0     0     0     G  0\n1 1 1 1    0    0    0    0    0  0    0    0    0    0  0     0     0     0     0  G
TEXT 3344 -360 Left 2 !.tran 0 1mS 0
TEXT 3016 472 Left 2 ;Q9=1
TEXT 3768 1152 Left 2 ;4 (0000-1111) İkil Seçici\n1101=13
TEXT 4208 752 Left 1 ;Q13=1
RECTANGLE Normal 4224 1040 3696 -336 2

The netlist it stands for:
* EBA2201o.asc
V1 1V+ 0 1V
A1 1V+ N006 N009 N014 N017 0 N007 0 AND
A2 1V+ N006 N009 N014 1V+ 0 N010 0 AND
A3 N007 N010 N015 N018 N020 0 N011 0 OR
A4 N030 0 0 0 0 N014 0 0 BUF
A5 1V+ N006 N009 N030 N017 0 N015 0 AND
A6 1V+ N006 N037 N030 1V+ 0 N040 0 AND
A7 1V+ 0 0 0 0 N017 0 0 BUF
XU1 N012 0 V20+ 0 N016 level3a  ; pins In+ In- V+ V- OUT
R1 N016 P001 1kΩ
D1 P001 0 AOT-2015
A8 N037 0 0 0 0 N009 0 0 BUF
A9 1V+ N006 N009 N030 1V+ 0 N018 0 AND
A10 1V+ N006 N037 N014 N017 0 N020 0 AND
A11 1V+ N006 N037 N014 1V+ 0 N038 0 AND
A12 1V+ N006 N037 N030 N017 0 N039 0 AND
A13 N038 N039 N040 N042 N045 0 N024 0 OR
A14 N011 N024 N027 N029 N029 0 N012 0 OR
A15 1V+ 1V+ N009 N014 N017 0 N042 0 AND
A16 1V+ 1V+ N009 N014 1V+ 0 N045 0 AND
A17 1V+ 1V+ N009 N030 N017 0 N061 0 AND
A18 1V+ 1V+ N037 N030 1V+ 0 N029 0 AND
A19 1V+ 1V+ N009 N030 1V+ 0 N062 0 AND
A20 1V+ 1V+ N037 N014 N017 0 N063 0 AND
A21 1V+ 1V+ N037 N014 1V+ 0 N064 0 AND
A22 1V+ 1V+ N037 N030 N017 0 N066 0 AND
A23 N061 N062 N063 N064 N066 0 N027 0 OR
A24 1V+ 0 0 0 0 N006 0 0 BUF
A25 1V+ N001 N003 N008 N013 0 N002 0 AND
A26 1V+ N001 N003 N008 1V+ 0 N019 0 AND
A27 1V+ 0 0 0 0 N003 0 0 BUF
A28 1V+ N001 N003 N028 N013 0 N023 0 AND
A29 1V+ N001 N003 N028 1V+ 0 N031 0 AND
A30 N028 0 0 0 0 N008 0 0 BUF
XU2 N002 0 V20+ 0 N004 level3a  ; pins In+ In- V+ V- OUT
R2 N005 N004 1kΩ
D2 N005 0 AOT-2015
XU3 N019 0 V20+ 0 N021 level3a  ; pins In+ In- V+ V- OUT
R3 N022 N021 1kΩ
D3 N022 0 AOT-2015
XU4 N023 0 V20+ 0 N025 level3a  ; pins In+ In- V+ V- OUT
R4 N026 N025 1kΩ
D4 N026 0 AOT-2015
XU5 N031 0 V20+ 0 N032 level3a  ; pins In+ In- V+ V- OUT
R5 N033 N032 1kΩ
D5 N033 0 AOT-2015
A32 1V+ N001 1V+ N008 N013 0 N034 0 AND
A33 1V+ N001 1V+ N008 1V+ 0 N041 0 AND
A34 1V+ N001 1V+ N028 N013 0 N046 0 AND
A35 1V+ N001 1V+ N028 1V+ 0 N049 0 AND
XU6 N034 0 V20+ 0 N035 level3a  ; pins In+ In- V+ V- OUT
R6 N036 N035 1kΩ
D6 N036 0 AOT-2015
XU7 N041 0 V20+ 0 N043 level3a  ; pins In+ In- V+ V- OUT
R7 N044 N043 1kΩ
D7 N044 0 AOT-2015
XU8 N046 0 V20+ 0 N047 level3a  ; pins In+ In- V+ V- OUT
R8 N048 N047 1kΩ
D8 N048 0 AOT-2015
XU9 N049 0 V20+ 0 N050 level3a  ; pins In+ In- V+ V- OUT
R9 N051 N050 1kΩ
D9 N051 0 AOT-2015
A36 1V+ 0 0 0 0 N013 0 0 BUF
A37 1V+ 0 0 0 0 N001 0 0 BUF
A38 1V+ 1V+ N003 N008 N013 0 N052 0 AND
A39 1V+ 1V+ N003 N008 1V+ 0 N055 0 AND
A40 1V+ 1V+ N003 N028 N013 0 N058 0 AND
A41 1V+ 1V+ N003 N028 1V+ 0 N065 0 AND
XU10 N052 0 V20+ 0 N053 level3a  ; pins In+ In- V+ V- OUT
R10 N054 N053 1kΩ
D10 N054 0 AOT-2015
XU11 N055 0 V20+ 0 N056 level3a  ; pins In+ In- V+ V- OUT
R11 N057 N056 1kΩ
D11 N057 0 AOT-2015
XU12 N058 0 V20+ 0 N059 level3a  ; pins In+ In- V+ V- OUT
R12 N060 N059 1kΩ
D12 N060 0 AOT-2015
XU13 N065 0 V20+ 0 N067 level3a  ; pins In+ In- V+ V- OUT
R13 N068 N067 1kΩ
D13 N068 0 AOT-2015
A42 1V+ 1V+ 1V+ N008 N013 0 N069 0 AND
A43 1V+ 1V+ 1V+ N008 1V+ 0 N072 0 AND
A44 1V+ 1V+ 1V+ N028 N013 0 N075 0 AND
A45 1V+ 1V+ 1V+ N028 1V+ 0 N078 0 AND
XU14 N069 0 V20+ 0 N070 level3a  ; pins In+ In- V+ V- OUT
R14 N071 N070 1kΩ
D14 N071 0 AOT-2015
XU15 N072 0 V20+ 0 N073 level3a  ; pins In+ In- V+ V- OUT
R15 N074 N073 1kΩ
D15 N074 0 AOT-2015
XU16 N075 0 V20+ 0 N076 level3a  ; pins In+ In- V+ V- OUT
R16 N077 N076 1kΩ
D16 N077 0 AOT-2015
XU17 N078 0 V20+ 0 N079 level3a  ; pins In+ In- V+ V- OUT
R17 N080 N079 1kΩ
D17 N080 0 AOT-2015
V2 V20+ 0 20V
.model D D
.lib standard.dio
* EBA2201o.asc: Elektronik simülasyon 34 temrini örneği.
* 01-5l • Temrin-34: Multiplexer ve Demultiplexer Devresi.  “2^n”  tane onlu giriş içerisinden "n" adet ikili seçme uçları yardımıyla seçilen girişi
*     tek çıkışa aktaran devrelere veri seçiciler (multiplexer/tekleyici) adı verilir. "n" adet ikili veri seçicilerde seçme ucu sayısına bağlı olarak
*     “2^n”  formülüne göre, seçilebilecek giriş sayısı artar. Burada “n”, ikili seçme ucu sayısıdır. Tek bir hattan bilgi alan ve bu bilgiyi olası “2^n”
*     adet onlu çıkış hattından biri üzerinden ileten bir devreye veri dağıtıcı (demultiplexer/çoklayıcı) denir. Belli bir çıkış hattının seçimi “n” adet
*     ikili seçme ucunun durumu tarafından kontrol edilir. Girişteki bilgiyi seçme uçlarına bağlı olarak istenilen onlu çıkışa aktaran devrelerdir.
*     -Sağdaki ilk multiplexer/tekleyici 2**4=16-4-1 devrede, 16 girişin 9.uncusu seçilip, tek çıktıya yönlendirilmiştir. Qçık=1V ve Iled=(20V-
*     2.78V)/1kΩ=17.2mA okur.
*     -Sağdaki ikinci multiplexer/çoklayıcı 2**4=16-4-1 devrede, tek girişin 13.üncüsü seçilip, 13/16.ıncı çıktıya yönlendirilmiştir. Q13=1V ve
*     Iled=(20V-2.64V/1kΩ=17.36mA okur.
* D0
* D1
* Bool Q=D0A'B'C'D'+D1A'B'C'D+D2A'B'CD'+D3A'B'CD+D4A'BC'D'+D5A'BC'D+D6A'BCD'+D7A'BCD+
*     D8AB'C'D'+D9AB'C'D+D10AB'CD'+D11AB'CD+D12ABC'D'+D13ABC'D+D14ABCD'+D15ABCD
* C
* 16-4-1 Tekleyen
* D2
* D3
* D
* B
* D4
* D5
* D6
* D7
* 2**4=16 Ondalık (0-15) Giriş
* 4 (0000-1111) İkil Seçici
* 1001=9
* Q
* D8
* D9
* D10
* D11
* D12
* D13
* D14
* D15
* A
* Doğruluk Tablosu
* A    B    C    D    Q
* 0    0    0    0    D0
* 0    0    0    1    D1
* 0    0    1    0    D2
* 0    0    1    1    D3
* 0    1    0    0    D4
* 0    1    0    1    D5
* 0    1    1    0    D6
* 0    1    1    1    D7
* 1    0    0    0    D8
* 1    0    0    1    D9
* 1    0    1    0    D10
* 1    0    1    1    D11
* 1    1    0    0    D12
* 1    1    0    1    D13
* 1    1    1    0    D14
* 1    1    1    1    D15
* A
* 1-4-16 Çoklayan
* B
* G
* Q3=GA'B'CD
* Q2=GA'B'CCD'
* Q1=GA'B'C'D
* Q0=GA'B'C'D'
* Tek giriş
* Q7=GA'BCD
* Q6=GA'BCD'
* Q5=G'A'BC'D
* Q4=GA'BC'D'
* C
* A
* Q11=GAB'CD
* Q10=GAB'CD'
* Q9=GAB'C'D
* Q8=GAB'C'D'
* Q15=GABCD
* Q14=GABCD'
* Q13=GABC'D
* Q12=GABC'D'
* 1'e 16 çoklayan
* Doğruluk Tablosu
* A B C D  Q0 Q1 Q2 Q3 Q4 Q5 Q6 Q7 Q8 Q9 QA QB QC QD QE QF
* 0 0 0 0    G    0    0    0    0  0    0    0    0    0  0     0     0     0     0  0
* 0 0 0 1    0    G    0    0    0  0    0    0    0    0  0     0     0     0     0  0
* 0 0 1 0    0    0    G    0    0  0    0    0    0    0  0     0     0     0     0  0
* 0 0 1 1    0    0    0    G    0  0    0    0    0    0  0     0     0     0     0  0
* 0 1 0 0    0    0    0    0    G  0    0    0    0    0  0     0     0     0     0  0
* 0 1 0 1    0    0    0    0    0  G    0    0    0    0  0     0     0     0     0  0
* 0 1 1 0    0    0    0    0    0  0    G    0    0    0  0     0     0     0     0  0
* 0 1 1 1    0    0    0    0    0  0    0    G    0    0  0     0     0     0     0  0
* 1 0 0 0    0    0    0    0    0  0    0    0    G    0  0     0     0     0     0  0
* 1 0 0 1    0    0    0    0    0  0    0    0    0    G  0     0     0     0     0  0
* 1 0 1 0    0    0    0    0    0  0    0    0    0    0  G     0     0     0     0  0
* 1 0 1 1    0    0    0    0    0  0    0    0    0    0  0     G     0     0     0  0
* 1 1 0 0    0    0    0    0    0  0    0    0    0    0  0     0     G     0     0  0
* 1 1 0 1    0    0    0    0    0  0    0    0    0    0  0     0     0     G     0  0
* 1 1 1 0    0    0    0    0    0  0    0    0    0    0  0     0     0     0     G  0
* 1 1 1 1    0    0    0    0    0  0    0    0    0    0  0     0     0     0     0  G
.tran 0 1mS 0
* Q9=1
* 4 (0000-1111) İkil Seçici
* 1101=13
* Q13=1
.backanno
.end